# Altium schematic sheet Power Selection - Temperature Sense.SchDoc: Title
size B; Organization: Midnight Sun Solar Rayce Car Team; Address1: University of Waterloo; Address2: 200 University Ave W; Address3: Waterloo, ON, Canada; Address4: N2L 3E9; Website: www.uwmidsun.com; ProjectName: ProjectName
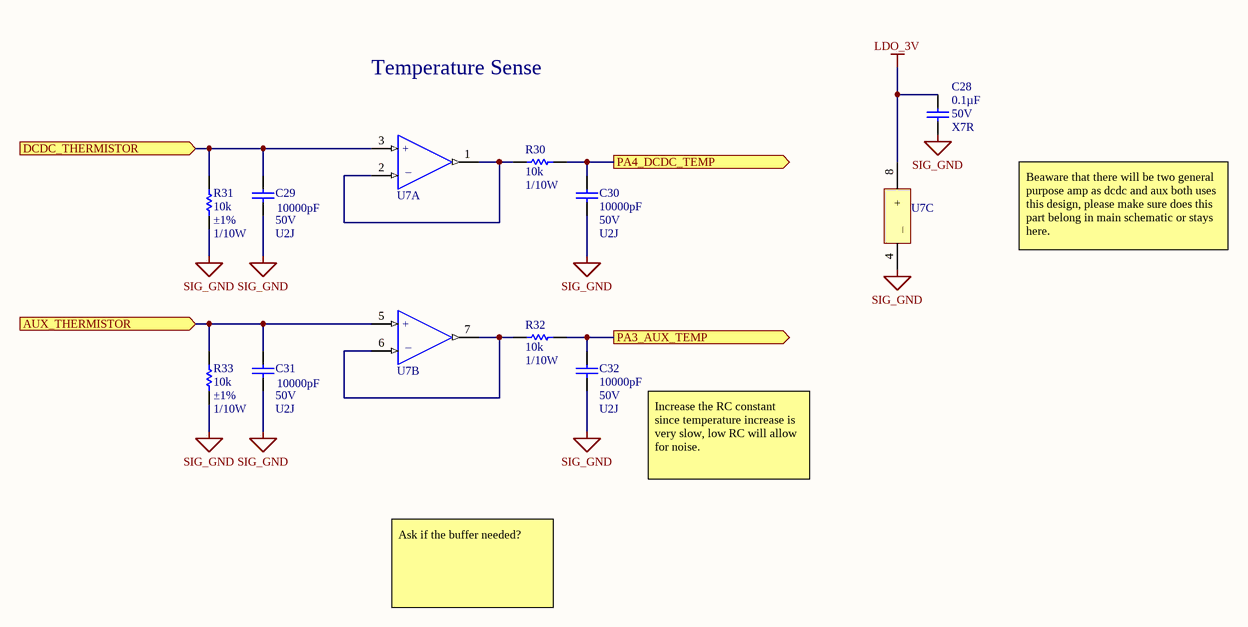
[diagram p0: Power Selection - Temperature Sense.SchDoc]

## Parts
C28  Capacitance: 0.1µF  Voltage: 50V  Temperature Coefficient: X7R  [CAP, 0603]  (hidden comment: CAP CER 0.1UF 50V 10% X7R 0603)
C29  Capacitance: 10000pF  Voltage: 50V  Temperature Coefficient: U2J  [CAP, 0603]  (hidden comment: CAP CER 10nF 50V 5% X7R 0603)
C30  Capacitance: 10000pF  Voltage: 50V  Temperature Coefficient: U2J  [CAP, 0603]  (hidden comment: CAP CER 10nF 50V 5% X7R 0603)
C31  Capacitance: 10000pF  Voltage: 50V  Temperature Coefficient: U2J  [CAP, 0603]  (hidden comment: CAP CER 10nF 50V 5% X7R 0603)
C32  Capacitance: 10000pF  Voltage: 50V  Temperature Coefficient: U2J  [CAP, 0603]  (hidden comment: CAP CER 10nF 50V 5% X7R 0603)
R30  Resistance: 10k  Power: 1/10W  [RES, 0603]  (hidden comment: RES 10K OHM 1% 1/10W 0603)
R31  Resistance: 10k  Tolerance: ±1%  Power: 1/10W  [RES, 0603]  (hidden comment: RES 10K OHM 1% 1/10W 0603)
R32  Resistance: 10k  Power: 1/10W  [RES, 0603]  (hidden comment: RES 10K OHM 1% 1/10W 0603)
R33  Resistance: 10k  Tolerance: ±1%  Power: 1/10W  [RES, 0603]  (hidden comment: RES 10K OHM 1% 1/10W 0603)
U7  IC OP AMP DUAL GP RR 10MHZ 8-VSSOP  [IC DUAL OPAMP OPA2197 8-VSSOP]  (value not drawn)  (parts A,B,C of 3)

## Ports
AUX_THERMISTOR (in), DCDC_THERMISTOR (in), PA3_AUX_TEMP (out), PA4_DCDC_TEMP (out)

## Nets
LDO_3V: C28.1 U7.8(+)
SIG_GND: C28.2 C29.2 C30.2 C31.2 C32.2 R31.2 R33.2 U7.4(_)
AUX_THERMISTOR: C31.1 R33.1 U7.5(+IN_B) ; port AUX_THERMISTOR
DCDC_THERMISTOR: C29.1 R31.1 U7.3(+IN_A) ; port DCDC_THERMISTOR
PA3_AUX_TEMP: C32.1 R32.2 ; port PA3_AUX_TEMP
PA4_DCDC_TEMP: C30.1 R30.2 ; port PA4_DCDC_TEMP
NetR30_1: R30.1 U7.1(OUT_A) U7.2(-IN_A)
NetR32_1: R32.1 U7.6(-IN_B) U7.7(OUT_B)

## Notes on the sheet
- Temperature Sense
- Beaware that there will be two general purpose amp as dcdc and aux both uses this design, please make sure does this part belong in main schematic or stays here.
- Increase the RC constant since temperature increase is very slow, low RC will allow for noise.
- Ask if the buffer needed?
- PROJECT
- DOCUMENT
- DRAWN BY
- LAST MODIFIED
- PART NUMBER
- REVISION
- SHEET
- VARIANT
- OF
- Engineering 5 - 1002
  University of Waterloo
  (519) 888-4567 x32978
  hardware@uwmidsun.com

## Library data of the parts
C28 = CAP CER 0.1UF 50V 10% X7R 0603: 0.10µF ±10% 50V Ceramic Capacitor X7R 0603 (1608 Metric); Manufacturer 1: AVX Corporation; Manufacturer Part Number 1: 06035C104KAT2A; Supplier 1: Digi-Key; Supplier Part Number 1: 478-5052-1-ND; Packaging: Cut Tape (CT); Part Status: Active; Operating Temperature: -55°C ~ 125°C; Ratings: -; Mounting Type: Surface Mount, MLCC; Package / Case: 0603 (1608 Metric); Size / Dimension: 0.063" L x 0.032" W (1.60mm x 0.81mm); Height - Seated (Max): -; Thickness (Max): 0.035" (0.90mm); Lead Spacing: -; Lead Style: -; ComponentLink1URL: http://datasheets.avx.com/X7RDielectric.pdf; ComponentLink1Description: http://datasheets.avx.com/X7RDielectric.pdf; Tolerance: ±10%
C29-C32 = CAP CER 10nF 50V 5% X7R 0603: 10000pF ±5% 50V Ceramic Capacitor U2J 0603 (1608 Metric); Manufacturer 1: KEMET; Manufacturer Part Number 1: C0603C103J5JAC7867; Supplier 1: Digi-Key; Supplier Part Number 1: 399-13384-1-ND; Packaging: Cut Tape (CT); Part Status: Active; Operating Temperature: -55°C ~ 125°C; Ratings: -; Failure Rate: -; Mounting Type: Surface Mount, MLCC; Package / Case: 0603 (1608 Metric); Size / Dimension: 0.063" L x 0.032" W (1.60mm x 0.80mm); Height - Seated (Max): -; Thickness (Max): 0.034" (0.87mm); Lead Spacing: -; Lead Style: -; ComponentLink1URL: http://www.kemet.com/docfinder?Partnumber=C0603C103J5JAC7867; ComponentLink1Description: http://www.kemet.com/docfinder?Partnumber=C0603C103J5JAC7867; Tolerance: ±5%
R30-R33 = RES 10K OHM 1% 1/10W 0603: RES SMD 10K OHM 1% 1/10W 0603; Manufacturer 1: Yageo; Manufacturer Part Number 1: RC0603FR-0710KL; Temperature Coefficient: ±100ppm/°C; Supplier 1: Digi-Key; Supplier Part Number 1: 311-10.0KHRCT-ND; Packaging: Cut Tape (CT); Part Status: Active; Composition: Thick Film; Operating Temperature: -55°C ~ 155°C; Package / Case: 0603 (1608 Metric); Supplier Device Package: 0603; Size / Dimension: 0.063" L x 0.031" W (1.60mm x 0.80mm); Height - Seated (Max): 0.022" (0.55mm); Failure Rate: -; ComponentLink1URL: http://www.yageo.com/documents/recent/PYu-RC_Group_51_RoHS_L_7.pdf; ComponentLink1Description: http://www.yageo.com/documents/recent/PYu-RC_Group_51_RoHS_L_7.pdf
  R30 R32: Tolerance: ±1%
U7 = IC OP AMP DUAL GP RR 10MHZ 8-VSSOP: General Purpose Amplifier 2 Circuit Rail-to-Rail 8-VSSOP; Manufacturer: Texas Instruments; Manufacturer Part Number: OPA2197IDGKR; Number of Circuits: 2; Slew Rate: 20V/µs; Input Bias Current: 5pA; Input Offset Voltage (Vos): 250uV; Operating Supply Current: 1mA; Output Current per Channel: 65mA; Supplier 1: Digi-Key; Stock 1: 2171; Pricing 1: 1=2.41, 10=2.162, 100=1.7376, 500=1.4276, 1000=1.1829 (USD); Mount: Surface Mount; Case/Package: VSSOP; Min Operating Temperature: -40°C; Max Operating Temperature: 125°C; Packaging: Tape and Reel; Gain Bandwidth Product: 10MHz; Number of Channels: 2; Lead Free: Lead Free; ComponentLink1URL: http://www.ti.com/lit/ds/symlink/opa2197.pdf; ComponentLink1Description: http://www.ti.com/lit/ds/symlink/opa2197.pdf; Supplier Part Number 1: 296-47349-1-ND